# Altium schematic sheet schematic.SchDoc
size A4; SheetNumber: 6; SheetTotal: 29
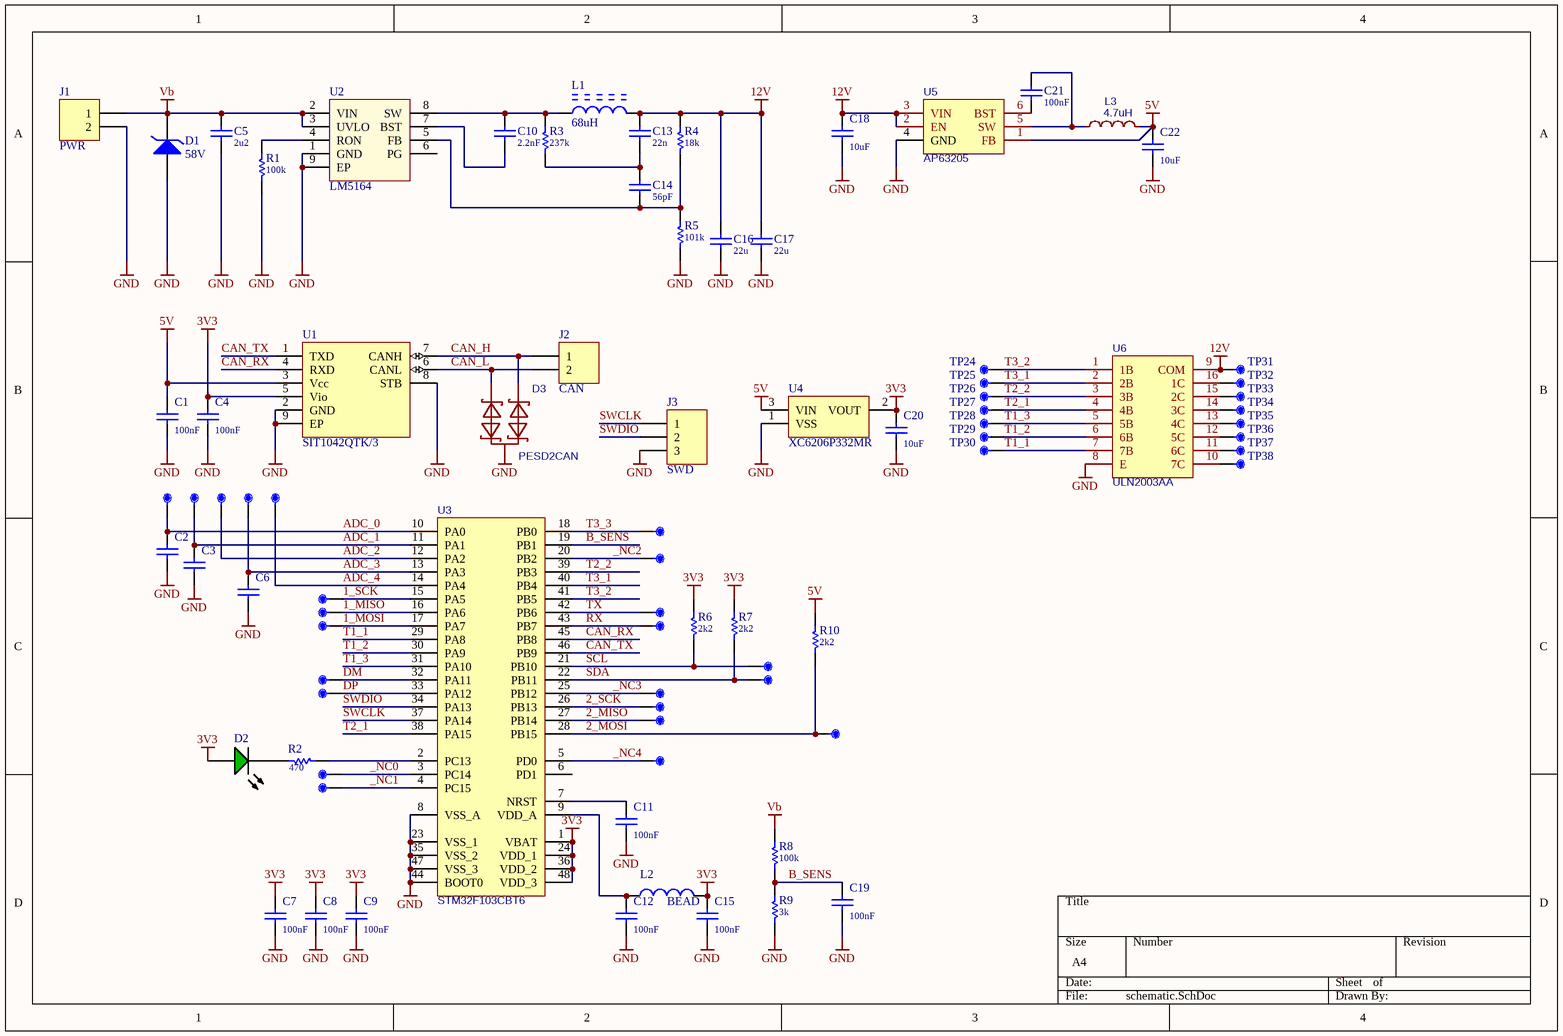
[diagram p0: schematic.SchDoc]

## Parts
C1  100nF  [C0402]
C2  100nF  [C0402]  (value not drawn)
C3  100nF  [C0402]  (value not drawn)
C4  100nF  [C0402]
C5  2u2  [C1210]
C6  100nF  [C0402]  (value not drawn)
C7  100nF  [C0402]
C8  100nF  [C0402]
C9  100nF  [C0402]
C10  2.2nF  [C0603]
C11  100nF  [C0402]
C12  100nF  [C0402]
C13  22n  [C0603]
C14  56pF  [C0603]
C15  100nF  [C0402]
C16  22u  [C1210]
C17  22u  [C1210]
C18  10uF  [C1206]
C19  100nF  [C0402]
C20  10uF  [C0603]
C21  100nF  [C0402]
C22  10uF  [C1206]
D1  58V  [SMA]
D2  GRN  [LED-0603-GRN]  (value not drawn)
D3  PESD2CAN  [SOT-23]
J1  PWR  [HDR-1X2]  (no BOM)
J2  CAN  [HDR-1X2]  (no BOM)
J3  SWD  [HDR-1x3-P1.25]  (no BOM)
L1  68uH  [L0605-POWER]
L2  BEAD  [L0402]
L3  4.7uH  [IND-SMD_L4.4-W4.2]
R1  100k  [R0603]
R2  470  [R0402]
R3  237k  [R0603]
R4  18k  [R0603]
R5  101k  [R0603]
R6  2k2  [R0402]
R7  2k2  [R0402]
R8  100k  [R0603]
R9  3k  [R0603]
R10  2k2  [R0402]
TP1  (no value)  [TP_THT]  (no BOM)
TP2  (no value)  [TP_THT]  (no BOM)
TP3  (no value)  [TP_THT]  (no BOM)
TP4  (no value)  [TP_THT]  (no BOM)
TP5  (no value)  [TP_THT]  (no BOM)
TP6  (no value)  [TP_THT]  (no BOM)
TP7  (no value)  [TP_THT]  (no BOM)
TP8  (no value)  [TP_THT]  (no BOM)
TP9  (no value)  [TP_THT]  (no BOM)
TP10  (no value)  [TP_THT]  (no BOM)
TP11  (no value)  [TP_THT]  (no BOM)
TP12  (no value)  [TP_THT]  (no BOM)
TP13  (no value)  [TP_THT]  (no BOM)
TP14  (no value)  [TP_THT]  (no BOM)
TP15  (no value)  [TP_THT]  (no BOM)
TP16  (no value)  [TP_THT]  (no BOM)
TP17  (no value)  [TP_THT]  (no BOM)
TP18  (no value)  [TP_THT]  (no BOM)
TP19  (no value)  [TP_THT]  (no BOM)
TP20  (no value)  [TP_THT]  (no BOM)
TP21  (no value)  [TP_THT]  (no BOM)
TP22  (no value)  [TP_THT]  (no BOM)
TP23  (no value)  [TP_THT]  (no BOM)
TP24  (no value)  [TP_THT]  (no BOM)
TP25  (no value)  [TP_THT]  (no BOM)
TP26  (no value)  [TP_THT]  (no BOM)
TP27  (no value)  [TP_THT]  (no BOM)
TP28  (no value)  [TP_THT]  (no BOM)
TP29  (no value)  [TP_THT]  (no BOM)
TP30  (no value)  [TP_THT]  (no BOM)
TP31  (no value)  [TP_THT]  (no BOM)
TP32  (no value)  [TP_THT]  (no BOM)
TP33  (no value)  [TP_THT]  (no BOM)
TP34  (no value)  [TP_THT]  (no BOM)
TP35  (no value)  [TP_THT]  (no BOM)
TP36  (no value)  [TP_THT]  (no BOM)
TP37  (no value)  [TP_THT]  (no BOM)
TP38  (no value)  [TP_THT]  (no BOM)
U1  SIT1042QTK/3  [DFN8_3X3_P065]
U2  LM5164  [PowerSOIC-8]
U3  STM32F103CBT6  [LQFP-48]
U4  XC6206P332MR  [SOT-23]
U5  AP63205  [SOT-23-6]
U6  ULN2003AA  [SOIC-16]

## Nets
3V3: C4.2 C7.2 C8.2 C9.2 C15.2 C20.2 D2.1(A) L2.1 R6.2 R7.2 U1.5(Vio) U3.1(VBAT) U3.24(VDD_1) U3.36(VDD_2) U3.48(VDD_3) U4.2(VOUT)
5V: C1.2 C22.2 L3.2 R10.2 U1.3(Vcc) U4.3(VIN) U5.1(FB)
12V: C13.2 C16.2 C17.2 C18.2 L1.2 R4.1 TP31.1 U5.2(EN) U5.3(VIN) U6.9(COM)
GND: C1.1 C2.1 C3.1 C4.1 C5.1 C6.1 C7.1 C8.1 C9.1 C11.1 C12.1 C15.1 C16.1 C17.1 C18.1 C19.1 C20.1 C22.1 D1.1(-) D3.3 J1.2 J3.3 R1.2 R5.2 R9.1 U1.2(GND) U1.8(STB) U1.9(EP) U2.1(GND) U2.9(EP) U3.8(VSS_A) U3.23(VSS_1) U3.35(VSS_2) U3.44(BOOT0) U3.47(VSS_3) U4.1(VSS) U5.4(GND) U6.8(E)
Vb: C5.2 D1.2(+) J1.1 R8.2 U2.2(VIN) U2.3(UVLO)
1_MISO: TP7.1 U3.16(PA6)
1_MOSI: TP8.1 U3.17(PA7)
1_SCK: TP6.1 U3.15(PA5)
2_MISO: TP19.1 U3.27(PB14)
2_MOSI: R10.1 TP23.1 U3.28(PB15)
2_SCK: TP18.1 U3.26(PB13)
_NC0: TP11.1 U3.3(PC14)
_NC1: TP12.1 U3.4(PC15)
_NC2: TP14.1 U3.20(PB2)
_NC3: TP17.1 U3.25(PB12)
_NC4: TP20.1 U3.5(PD0)
ADC_0: C2.2 TP1.1 U3.10(PA0)
ADC_1: C3.2 TP2.1 U3.11(PA1)
ADC_2: TP3.1 U3.12(PA2)
ADC_3: C6.2 TP4.1 U3.13(PA3)
ADC_4: TP5.1 U3.14(PA4)
B_SENS: C19.2 R8.1 R9.2 U3.19(PB1)
CAN_H: D3.2 J2.1 U1.7(CANH)
CAN_L: D3.1 J2.2 U1.6(CANL)
CAN_RX: U1.4(RXD) U3.45(PB8)
CAN_TX: U1.1(TXD) U3.46(PB9)
DM: TP9.1 U3.32(PA11)
DP: TP10.1 U3.33(PA12)
RX: TP16.1 U3.43(PB7)
SCL: R6.1 TP21.1 U3.21(PB10)
SDA: R7.1 TP22.1 U3.22(PB11)
SWCLK: J3.1 U3.37(PA14)
SWDIO: J3.2 U3.34(PA13)
T1_1: TP30.1 U3.29(PA8) U6.7(7B)
T1_2: TP29.1 U3.30(PA9) U6.6(6B)
T1_3: TP28.1 U3.31(PA10) U6.5(5B)
T2_1: TP27.1 U3.38(PA15) U6.4(4B)
T2_2: TP26.1 U3.39(PB3) U6.3(3B)
T3_1: TP25.1 U3.40(PB4) U6.2(2B)
T3_2: TP24.1 U3.41(PB5) U6.1(1B)
T3_3: TP13.1 U3.18(PB0)
TX: TP15.1 U3.42(PB6)
NetC10_1: C10.1 U2.7(BST)
NetC10_2: C10.2 L1.1 R3.1 U2.8(SW)
NetC11_2: C11.2 U3.7(NRST)
NetC12_2: C12.2 L2.2 U3.9(VDD_A)
NetC13_1: C13.1 C14.2 R3.2
NetC14_1: C14.1 R4.2 R5.1 U2.5(FB)
NetC21_1: C21.1 U5.6(BST)
NetC21_2: C21.2 L3.1 U5.5(SW)
NetD2_2: D2.2(K) R2.1
NetR1_1: R1.1 U2.4(RON)
NetR2_2: R2.2 U3.2(PC13)
NetTP32_1: TP32.1 U6.16(1C)
NetTP33_1: TP33.1 U6.15(2C)
NetTP34_1: TP34.1 U6.14(3C)
NetTP35_1: TP35.1 U6.13(4C)
NetTP36_1: TP36.1 U6.12(5C)
NetTP37_1: TP37.1 U6.11(6C)
NetTP38_1: TP38.1 U6.10(7C)

Not connected (* = marked no-connect by the designer): U2 6(PG); U3 6(PD1)

## Library data of the parts
C1-C4 C6-C9 C11 C12 C15 C19 C21 = CAP: 100nF 50V 0402
C5 = CAP: 2.2uF 100V 1210
C10 = CAP: 2.2nF 50V 0603
C13 = CAP: 2.2nF 0603
C14 = CAP: 56pF 0603
C16 C17 = CAP: 22u 35V 1210
C18 C22 = CAP: 10uf 50V 1206; P/N: CL31B106KBHNNNE; LCSC part number: C89632
C20 = CAP: 10uf 50V 1206
D1 = NCP51460SN33T1G: SMAJ58A; P/N: SMCJ24A; LCSC part number: C693617
D2 = LED-0603-GREEN: LED 0603 GRN
D3 = CDSOT23-SM712: LCSC part number: C5261081; P/N: PESD2CAN
J1 J2 = Header 2
J3 = Header 3
L1 = SRN3015-100M: PSPMAA0605H-680M-IGF
L2 = BLM18AG601SN1D: BEAD 0402
L3 = 4.7uH: P/N: FXL0420-4R7-M; LCSC part number: C167208
R1 = RES: 100k 0603
R2 = RES: 470 0603
R3 = RES: 237k 0603
R4 = RES: 18k 1% 0603
R5 = RES: 101k 0603
R6-R10 = RES
TP1-TP38 = TP_Dup1
U1 = LTC2875: IC INTERFACE CAN
U4 = Component_4_1
U5 = AP63203WU-7: LCSC part number: C780769; P/N: AP63203WU-7
U6 = ULN2003A